# EAGLE design KitchenTimer_v2 (EAGLE 9.3.0)
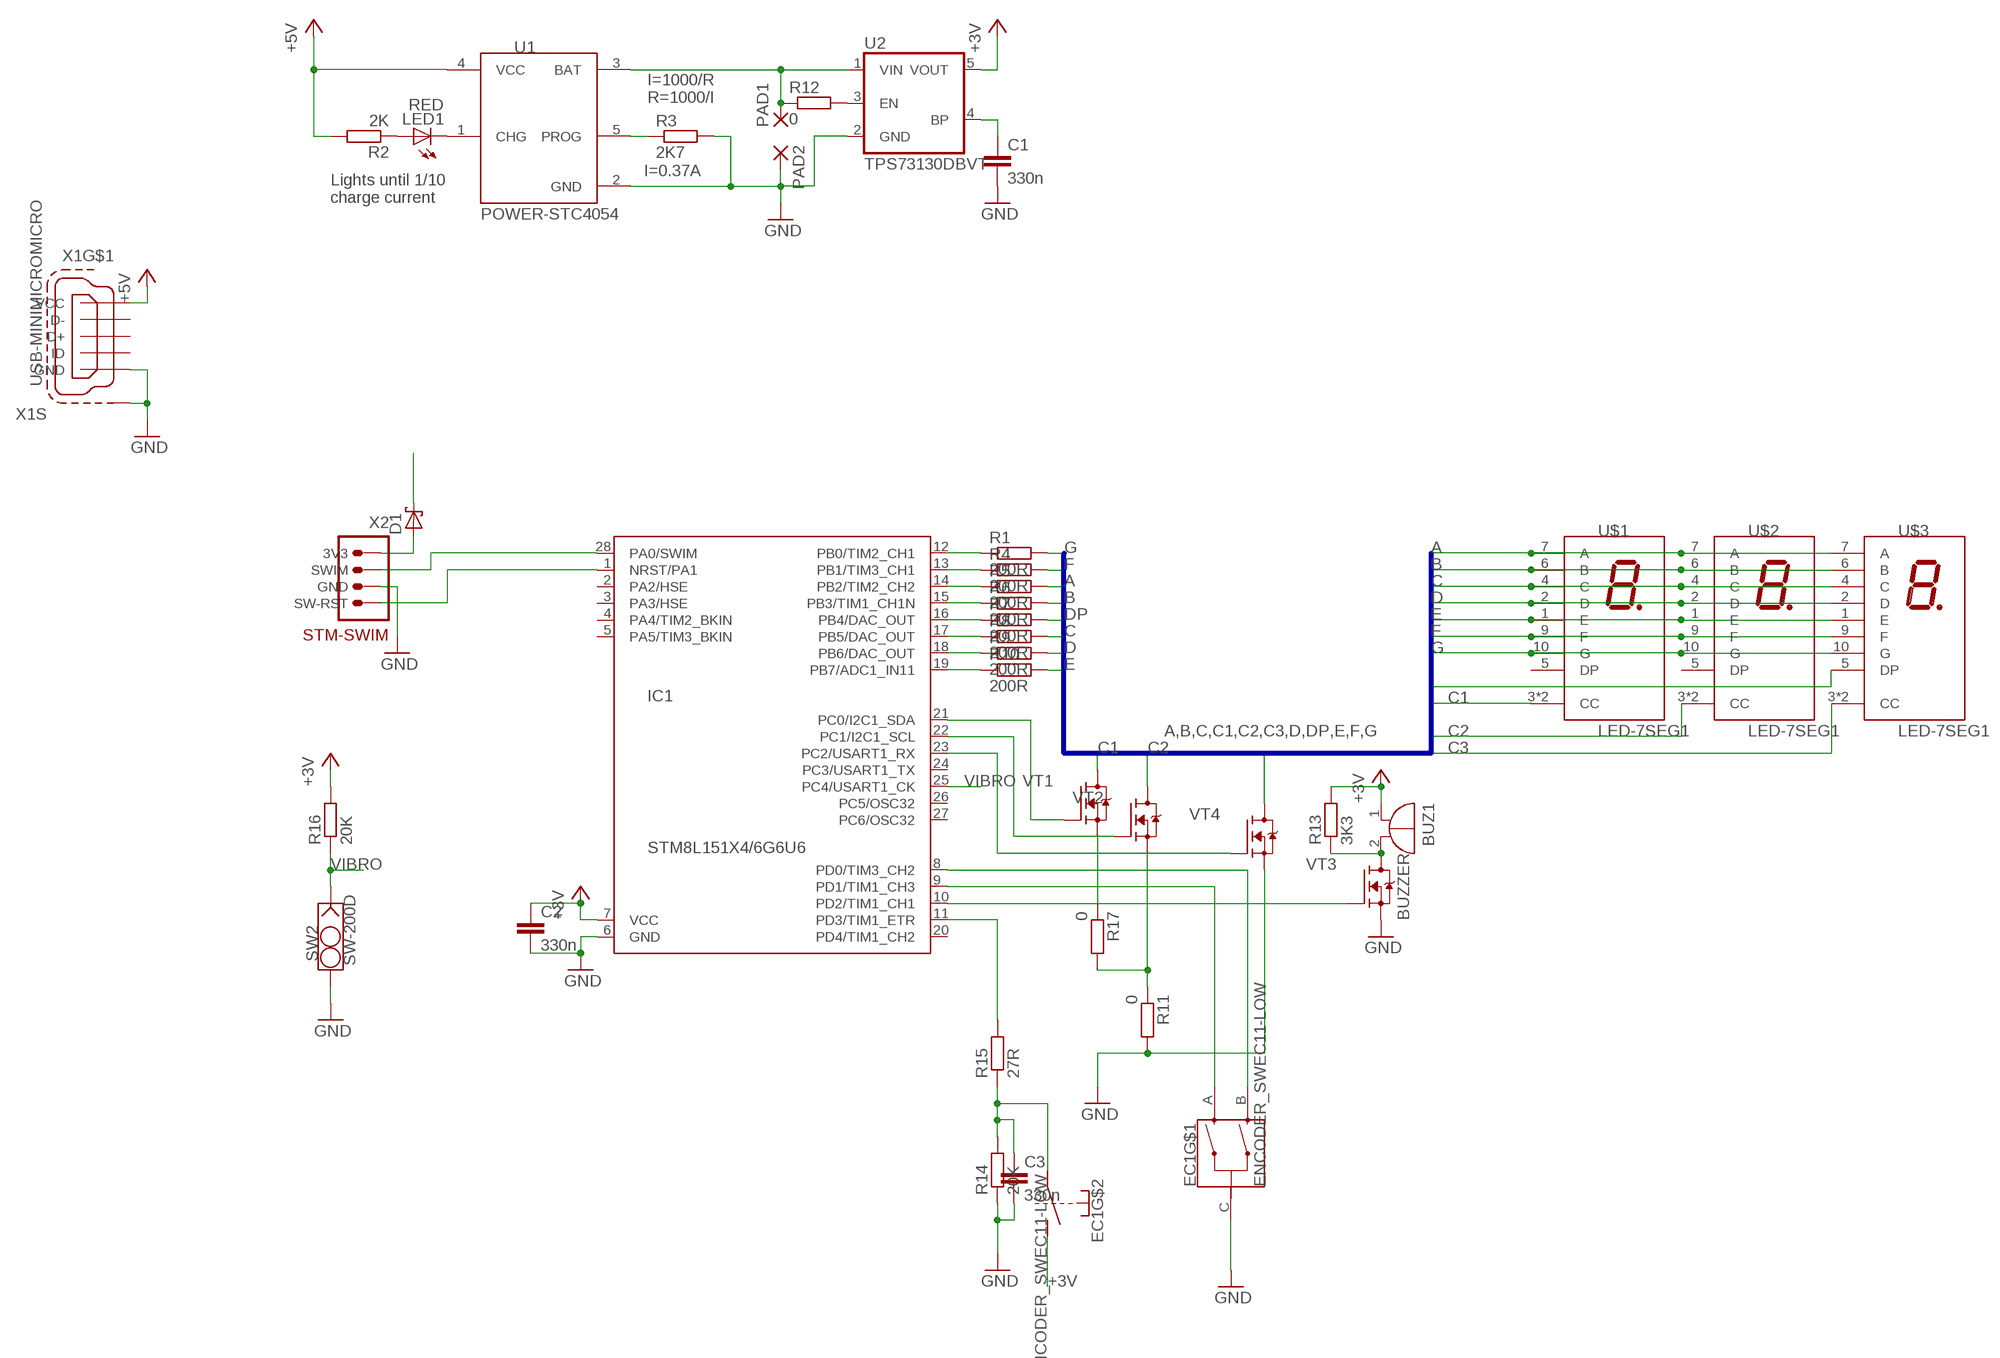
[diagram p0: schematic, sheet 1]

## Parts
BUZ1  BUZZER  [PIEZO-D12_H9]
C1  330n  CAP_1206  [CAP1206]
C2  330n  CAP_1206  [CAP1206]
C3  330n  CAP_1206  [CAP1206]
D1  DIODE-SH_SOD523  [SODFL1608X65]
EC1  ENCODER_SWEC11-LOW  [EC11E1544505]
IC1  STM8L151X4/6G6U6  [QFN28]
LED1  RED  LED_1206  [LED1206]
PAD1  1,6/0,9  [1,6/0,9]
PAD2  1,6/0,9  [1,6/0,9]
R1  200R  R_R0805  [RESC2012X50]
R2  2K  R_R0805  [RESC2012X50]
R3  2K7  R_R0805  [RESC2012X50]
R4  200R  R_R0805  [RESC2012X50]
R5  200R  R_R0805  [RESC2012X50]
R6  200R  R_R0805  [RESC2012X50]
R7  200R  R_R0805  [RESC2012X50]
R8  200R  R_R0805  [RESC2012X50]
R9  200R  R_R0805  [RESC2012X50]
R10  200R  R_R0805  [RESC2012X50]
R11  0  R_R0805  [RESC2012X50]
R12  0  R_R0805  [RESC2012X50]
R13  3K3  R_R1206  [RESC3216X60]
R14  20K  R_R1206  [RESC3216X60]
R15  27R  R_R1206  [RESC3216X60]
R16  20K  R_R1206  [RESC3216X60]
R17  0  R_R0805  [RESC2012X50]
SW2  SW-200D  [SW-200D]
U1  POWER-STC4054  [SOT95P280X145-5]
U2  TPS73130DBVT  VREG-LD2985  [SOT95P280X145-5]
U$1  LED-7SEG1  [LED-7SEG1]
U$2  LED-7SEG1  [LED-7SEG1]
U$3  LED-7SEG1  [LED-7SEG1]
VT1  FET-NSOT-23  [SOT95P240X115-3]
VT2  FET-NSOT-23  [SOT95P240X115-3]
VT3  FET-NSOT-23  [SOT95P240X115-3]
VT4  FET-NSOT-23  [SOT95P240X115-3]
X1  USB-MINIMICROMICRO  [USB-B-MICRO-SMD]
X2  STM-SWIMPOGOPADS  [SWIM-PADS-1.27]

## Nets
+3V: BUZ1.1(+) C2.1 D1.1(C) EC1.E IC1.7(VCC) R13.2 R16.2 U2.5(VOUT)
+5V: R2.2 U1.4(VCC) X1.VBUS(VCC)
A: R5.2 U$1.7(A) U$2.7(A) U$3.7(A)
B: R6.2 U$1.6(B) U$2.6(B) U$3.6(B)
C: R8.2 U$1.4(C) U$2.4(C) U$3.4(C)
C1: U$1.3(CC) U$1.8(CC) VT1.3(D)
C2: U$2.3(CC) U$2.8(CC) VT2.3(D)
C3: U$3.3(CC) U$3.8(CC) VT4.3(D)
D: R9.2 U$1.2(D) U$2.2(D) U$3.2(D)
DP: R7.2 U$3.5(DP)
E: R10.2 U$1.1(E) U$2.1(E) U$3.1(E)
F: R4.2 U$1.9(F) U$2.9(F) U$3.9(F)
G: R1.2 U$1.10(G) U$2.10(G) U$3.10(G)
GND: C1.2 C2.2 C3.2 EC1.C IC1.6(GND) PAD2.1(P) R3.2 R11.2 R14.1 SW2.S U1.2(GND) U2.2(GND) VT3.2(S) VT4.2(S) X1.GND X1.SHIELD1(S:S1) X1.SHIELD2(S:S1) X1.SHIELD3(S:S1) X2.P$3(GND)
N$1: LED1.C U1.1(CHG)
N$2: LED1.A R2.1
N$3: IC1.12(PB0/TIM2_CH1) R1.1
N$4: IC1.13(PB1/TIM3_CH1) R4.1
N$5: R3.1 U1.5(PROG)
N$6: IC1.14(PB2/TIM2_CH2) R5.1
N$7: PAD1.1(P) R12.1 U1.3(BAT) U2.1(VIN)
N$8: IC1.15(PB3/TIM1_CH1N) R6.1
N$9: IC1.16(PB4/DAC_OUT) R7.1
N$10: IC1.17(PB5/DAC_OUT) R8.1
N$11: IC1.18(PB6/DAC_OUT) R9.1
N$12: IC1.19(PB7/ADC1_IN11) R10.1
N$13: IC1.21(PC0/I2C1_SDA) VT1.1(G)
N$14: IC1.22(PC1/I2C1_SCL) VT2.1(G)
N$15: R11.1 R17.2 VT2.2(S)
N$16: R12.2 U2.3(EN)
N$17: C1.1 U2.4(BP)
N$18: BUZ1.2(-) R13.1 VT3.3(D)
N$19: IC1.10(PD2/TIM1_CH1) VT3.1(G)
N$20: C3.1 EC1.D R14.2 R15.1
N$21: IC1.11(PD3/TIM1_ETR) R15.2
N$22: IC1.28(PA0/SWIM) X2.P$2(SWIM)
N$23: IC1.1(NRST/PA1) X2.P$4(SW-RST)
N$24: D1.2(A) X2.P$1(3V3)
N$25: EC1.A IC1.9(PD1/TIM1_CH3)
N$26: EC1.B IC1.8(PD0/TIM3_CH2)
N$27: IC1.23(PC2/USART1_RX) VT4.1(G)
N$28: R17.1 VT1.2(S)
VIBRO: IC1.25(PC4/USART1_CK) R16.1 SW2.G
Unconnected: IC1.2(PA2/HSE) IC1.3(PA3/HSE) IC1.4(PA4/TIM2_BKIN) IC1.5(PA5/TIM3_BKIN) IC1.20(PD4/TIM1_CH2) IC1.24(PC3/USART1_TX) IC1.26(PC5/OSC32) IC1.27(PC6/OSC32) U$1.5(DP) U$2.5(DP) X1.D+ X1.D- X1.ID

## Buses
A,B,C,C1,C2,C3,D,DP,E,F,G

## Notes on the sheet
- I=1000/R
  R=1000/I
- I=0.37A
- Lights until 1/10
  charge current

## Library data of the parts
BUZ1 = Flamberm:BUZZER
C1-C3 = Flamberm:CAP_
D1 = Flamberm:DIODE-SH_
EC1 = Flamberm:ENCODER_SW
IC1 = Flamberm:STM8L151X4/6
LED1 = Flamberm:LED_
PAD1 PAD2 = wirepad:1,6/0,9: THROUGH-HOLE PAD
R1-R17 = Flamberm:R_
SW2 = Flamberm:SW-200D
U1 = Flamberm:POWER-STC4054
U2 = Flamberm:VREG-LD2985
U$1-U$3 = Flamberm:LED-7SEG1
VT1-VT4 = Flamberm:FET-N
X1 = Flamberm:USB-MINIMICRO: MINI USB-B Conector Source: www.cypressindustries.com
X2 = Flamberm:STM-SWIM

## Board
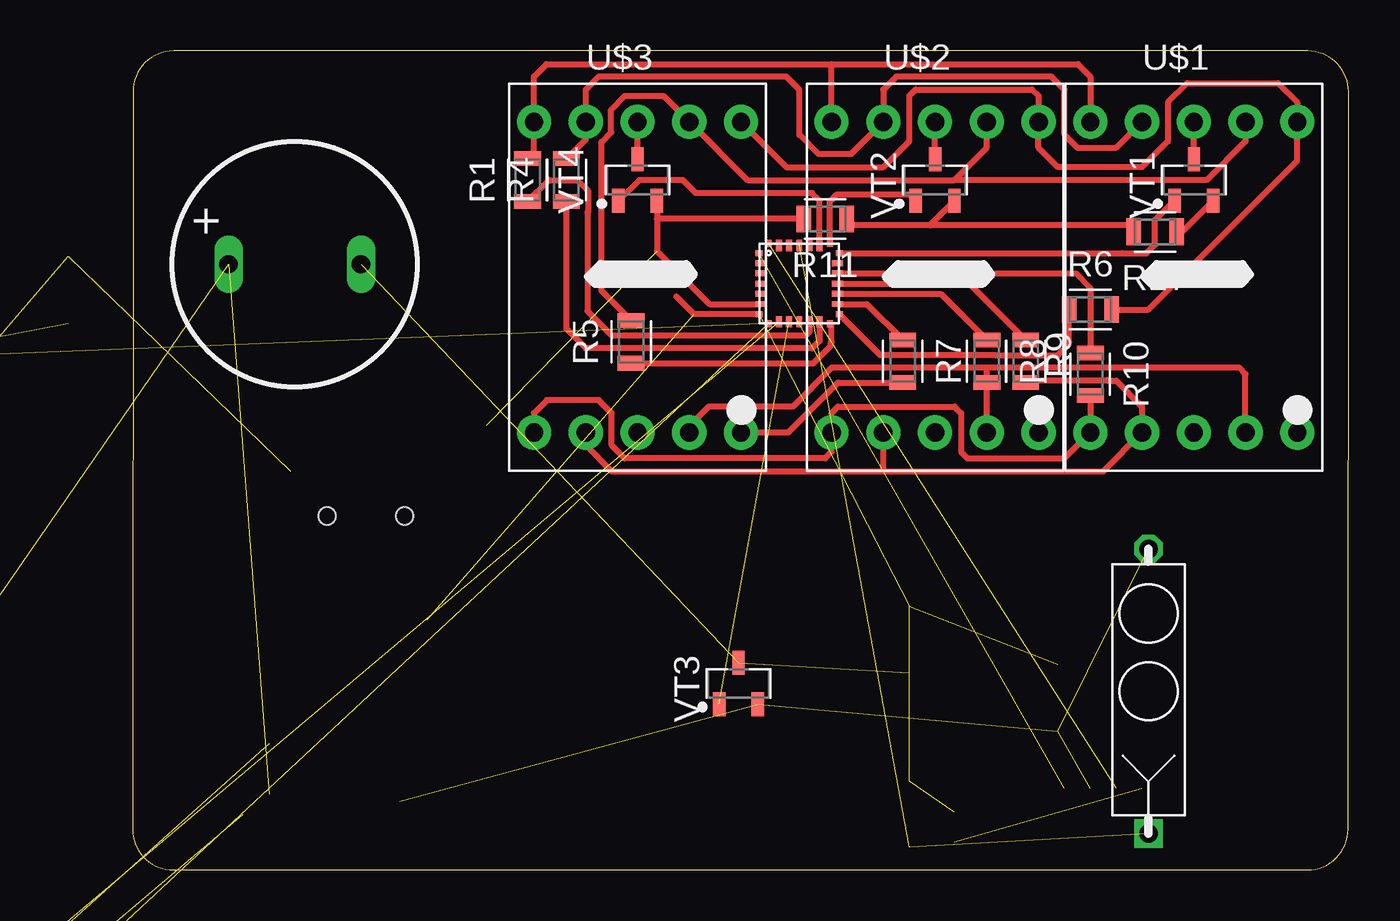
[diagram p1: board, top side]
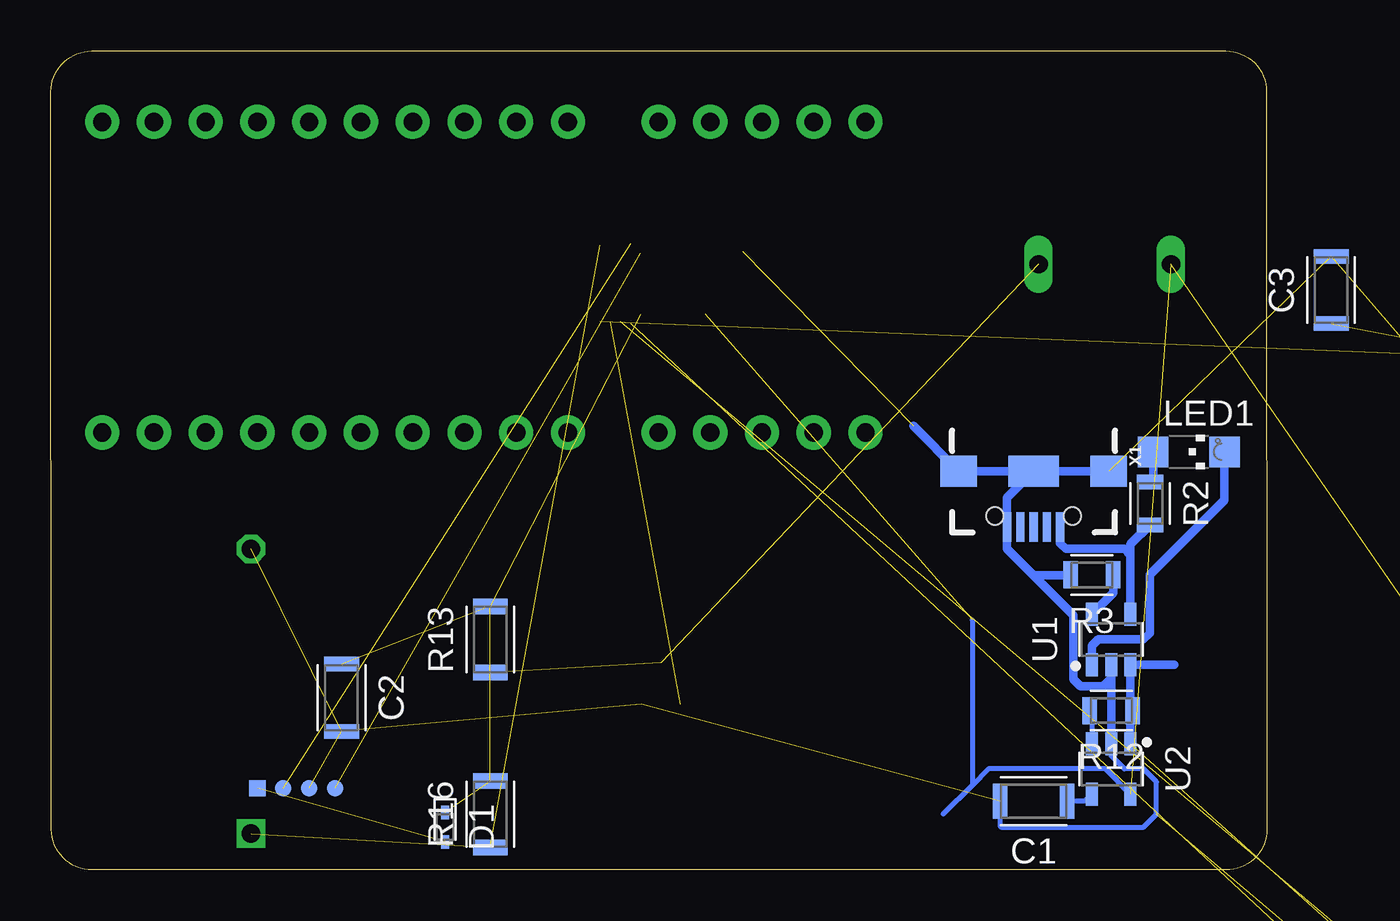
[diagram p2: board, bottom side, seen from below]

Size 59.69 x 40.18 mm. Coordinates in mm from the lower left corner, seen from the top.
Outline: 2,0 57.67,0 arc90 59.67,2 59.69,38.18 arc90 57.69,40.18 2.02,40.18 arc90 0.02,38.18 0,2 arc90 2,0
Copper layers (1*16): Top 0.035mm / dielectric 1.5mm / Bottom 0.035mm
Design rules "EagleDesignRules": minimum track width 0.25mm, minimum drill 0.3mm, track to track 0.25mm, track to pad 0.25mm, pad to pad 0.25mm, via to via 0.25mm, smd to smd 0.25mm, copper to edge 0.5mm, drill to drill 0.5mm, minimum pad ring 10mil, minimum via ring 8mil, stop-mask expansion 4mil, vias tented up to drill 0mil, thermal gap 0.25mm

### Footprints (pad centres in the part's own frame; a part is rotated, then mirrored left to right if it is on the bottom)
PIEZO-D12_H9 = drill 0.9 long: 1 -3.25,0; 2 3.25,0
CAP1206 = smd 0.712 x 1.712: 1 -1.65,0; 2 1.65,0
SODFL1608X65 = smd 0.66 x 0.398: 1 -0.72,0; 2 0.72,0
EC11E1544505 = smd 1.3 x 2.4: A -2.5,-7.3; B 2.5,-7.3; C 0,-7.3; D -2.5,7; E 2.5,7 | smd 3.75 x 4: P$1 -6.375,0; P$2 6.375,0 | smd 2.5 x 3.2: P$3 -5,7.9; P$4 5,7.9; P$5 5,-7.9; P$6 -5,-7.9 | hole 2: 0,0 | hole 1.5: 0,-4.5
QFN28 = smd 0.35 x 0.29: 1 -1.975,1.5; 7 -1.975,-1.5; 15 1.975,-1.5; 21 1.975,1.5 | smd 0.55 x 0.29: 2 -1.875,1; 3 -1.875,0.5; 4 -1.875,0; 5 -1.875,-0.5; 6 -1.875,-1; 16 1.875,-1; 17 1.875,-0.5; 18 1.875,0; 19 1.875,0.5; 20 1.875,1 | smd 0.29 x 0.35: 8 -1.5,-1.975; 14 1.5,-1.975; 22 1.5,1.975; 28 -1.5,1.975 | smd 0.29 x 0.55: 9 -1,-1.875; 10 -0.5,-1.875; 11 0,-1.875; 12 0.5,-1.875; 13 1,-1.875; 23 1,1.875; 24 0.5,1.875; 25 0,1.875; 26 -0.5,1.875; 27 -1,1.875
LED1206 = smd 1.5 x 1.5: A 0,-1.75; C 0,1.75
1,6/0,9 = drill 0.914 pad 1.6 octagon: 1 0,0
RESC2012X50 = smd 0.712 x 1.312: 1 -1.05,0; 2 1.05,0
RESC3216X60 = smd 0.762 x 1.712: 1 -1.625,0; 2 1.625,0
SW-200D = drill 0.9 square: G 6.985,0 | drill 0.9 octagon: S -6.985,0
SOT95P280X145-5 = smd 1.127 x 0.589: 1 -1.242,0.95; 2 -1.242,0; 3 -1.242,-0.95; 4 1.242,-0.95; 5 1.242,0.95
LED-7SEG1 = drill 0.9 pad 1.676: 1 -5.08,-7.62; 2 -2.54,-7.62; 3 0,-7.62; 4 2.54,-7.62; 5 5.08,-7.62; 6 5.08,7.62; 7 2.54,7.62; 8 0,7.62; 9 -2.54,7.62; 10 -5.08,7.62
SOT95P240X115-3 = smd 1.18 x 0.609: 1 -1.024,0.95; 2 -1.024,-0.95; 3 1.024,0
USB-B-MICRO-SMD = smd 1.45 x 0.4: D+ 2.725,0; D- 2.725,0.65; GND 2.725,-1.3; ID 2.725,-0.65; VBUS 2.725,1.3 | smd 1.5 x 1.8: SHIELD1 0,3.685; SHIELD2 0,-3.685 | smd 1.5 x 2.5: SHIELD3 0,0 | hole 0.85: 2.2,1.9; 2.2,-1.9
SWIM-PADS-1.27 = smd 0.8 x 0.8: P$1 -1.27,0; P$2 0,0; P$3 1.27,0; P$4 2.54,0

### Placement (x,y rotation side)
BUZ1  7.96,29.72 0 top
C1  11.45,3.37 180 bottom
C2  45.42,8.45 270 bottom
C3  -3.16,28.45 90 bottom  (outside the outline)
D1  40.34,2.1 270 bottom
EC1  -23.48,-14.41 0 top  (outside the outline)
IC1  32.72,28.77 0 top
LED1  3.83,20.51 270 bottom
PAD1  -30.46,-27.11 0 top  (outside the outline)
PAD2  -30.46,-31.24 0 top  (outside the outline)
R1  19.39,33.85 90 top
R2  5.73,17.97 270 bottom
R3  8.59,14.48 180 bottom
R4  21.29,33.85 90 top
R5  24.47,25.91 90 top
R6  47.01,27.5 0 top
R7  37.8,24.96 270 top
R8  41.93,24.96 270 top
R9  43.83,24.96 270 top
R10  47.01,24.32 270 top
R11  33.99,31.94 180 top
R12  7.64,7.81 180 bottom
R13  38.12,11.3 90 bottom
R14  -9.19,21.46 270 bottom  (outside the outline)
R15  -9.51,25.27 180 bottom  (outside the outline)
R16  38.12,2.73 90 bottom
R17  50.18,31.31 180 top
SW2  49.87,8.76 270 top
U1  7.64,11.3 90 bottom
U2  7.64,4.95 270 bottom
U$1  52.09,29.08 0 top
U$2  39.39,29.08 0 top
U$3  24.78,29.08 0 top
VT1  52.09,33.85 90 top
VT2  39.39,33.85 90 top
VT3  29.74,9.14 90 top
VT4  24.78,33.85 90 top
X1  11.45,19.56 270 bottom
X2  48.28,4 0 bottom

### Tracks (layer width: path | path; a pad name or v marks a point on that pad's centre or on a via)
+3V  (7 unrouted)
  Top 0.305: IC1.7 27.55,27.27 26.69,28.13
  Bottom 0.25: U2.5 7.93,4.95 13.67,4.95 14.47,4.16 | 14.47,4.16 15.89,2.73 | 14.47,12.26 14.47,4.16
+5V
  Bottom 0.406: U1.4 6.69,15.43 | 6.69,15.43 6.69,15.97 R2.2 | X1.VBUS 10.15,16.04 9.86,15.75 7.01,15.75 6.69,15.43
A
  Top 0.305: 40.34,33.84 41.93,35.43 U$2.7 | U$1.7 54.63,35.75 52.72,33.84 40.34,33.84 | 40.34,33.84 30.18,33.84 U$3.7 26.05,37.97 24.15,37.97 23.49,37.31 23.49,36.19 23.01,35.71 23.01,28.42 R5.2 24.47,26.86
B
  Top 0.305: U$3.6 32.09,34.48 36.85,34.48 38.12,35.75 38.12,37.97 38.44,38.29 44.15,38.29 44.47,37.97 U$2.6 | U$2.6 44.47,36.07 | U$2.6 44.47,35.43 45.42,34.48 49.55,34.48 50.82,35.75 50.82,37.65 51.77,38.61 56.22,38.61 57.17,37.65 U$1.6 57.17,34.8 51.77,29.4 51.61,29.24 49.87,27.5 R6.2
C
  Top 0.305: U$1.4 54.63,24.32 54.31,24.64 41.93,24.64 | 41.93,24.64 34.31,24.64 32.4,22.73 28.28,22.73 27.32,21.78 U$3.4 | U$2.4 R8.2 41.93,24.64
C1
  Top 0.305: VT1.3 U$1.8
C2
  Top 0.305: VT2.3 U$2.8
C3
  Top 0.305: VT4.3 U$3.8
D
  Top 0.305: U$3.2 22.24,20.83 23.51,19.56 36.85,19.56 | 36.85,19.56 U$2.2 | 36.85,19.56 47.64,19.56 U$1.2 49.55,22.73 48.28,24 47.86,24 47.83,24.03 43.96,24.03 R9.2
DP
  Top 0.305: R7.2 34.63,23.91 32.18,21.46 U$3.5
E
  Top 0.305: U$3.1 19.7,22.42 20.34,23.05 22.88,23.05 23.51,22.42 23.51,20.83 24.15,20.19 33.99,20.19 34.31,20.51 U$2.1 34.31,22.42 34.63,22.73 40.34,22.73 40.66,22.42 40.66,20.51 40.98,20.19 45.74,20.19 U$1.1 R10.2
F
  Top 0.305: U$1.9 48.28,35.43 46.37,35.43 45.74,36.07 45.74,38.29 45.1,38.93 37.48,38.93 36.85,38.29 U$2.9 35.26,35.11 33.67,35.11 32.72,36.07 32.72,38.29 32.09,38.93 22.88,38.93 22.24,38.29 U$3.9 22.24,35.85 R4.2
G
  Top 0.305: U$1.10 47.01,38.93 46.4,39.53 34.31,39.53 | 34.31,39.53 20.31,39.53 19.7,38.93 U$3.10 19.7,35.21 R1.2 | U$2.10 34.31,39.53
GND  (9 unrouted)
  Top 0.305: IC1.6 28.32,27.77 25.73,30.36 25.73,31.94 | VT4.2 25.73,31.94 | R11.2 25.73,31.94
  Bottom 0.25: U2.2 7.64,5.59 7,4.95 6.05,4.95 5.42,4.32 5.42,2.73 6.05,2.1 13.04,2.1 13.1,2.16 C1.2
  Bottom 0.406: X1.SHIELD3 12.75,18.26 X1.GND 12.75,15.75 11.46,14.46 | X1.SHIELD3 X1.SHIELD2 17.36,21.78 | X1.SHIELD3 X1.SHIELD1 | U1.2 7.64,9.4 | 7.64,9.4 8.02,9.02 9.16,9.02 9.49,9.34 9.49,12.48 11.46,14.46 | R3.2 9.66,14.46 11.46,14.46 | U2.2 7.64,9.4
N$1
  Bottom 0.406: LED1.C 2.08,18.13 5.73,14.48 5.73,11.62 6.05,11.3 8.27,11.3 8.59,10.99 U1.1
N$2
  Bottom 0.406: R2.1 5.58,19.18 LED1.A
N$3
  Top 0.305: R1.1 20.44,33.84 21.82,33.84 22.32,33.34 22.35,33.32 22.35,32.27 22.32,32.25 22.32,27.42 23.54,26.2 33.02,26.2 33.22,26.4 IC1.12
N$4
  Top 0.305: R4.1 21.29,26.54 22.24,25.59 33.36,25.59 33.72,25.96 IC1.13
N$5
  Bottom 0.406: R3.1 7.54,13.59 U1.5
N$6
  Top 0.305: 34.28,25.88 34.28,25.73 33.41,24.86 R5.1 | 34.28,25.88 34.31,25.91 | IC1.14 34.28,26.74 34.28,25.88
N$7  (1 unrouted)
  Bottom 0.25: R12.1 6.69,7.81
  Bottom 0.406: 4.53,10.06 U1.3 6.69,7.81 U2.1
N$8
  Top 0.305: IC1.15 36.69,25.27 42.35,25.27 42.38,25.25 45.42,25.25 45.95,25.78 45.95,25.89 45.96,25.9 R6.1
N$9
  Top 0.305: IC1.16 36.04,27.77 R7.1
N$10
  Top 0.305: IC1.17 39.67,28.27 R8.1
N$11
  Top 0.305: IC1.18 41.07,28.77 R9.1
N$12
  Top 0.305: IC1.19 46.29,29.27 47.01,28.55 R10.1
N$13
  Top 0.305: IC1.21 48.59,30.27 48.61,30.25 49.76,30.25 50.18,30.67 50.18,31.87 VT1.1
N$14
  Top 0.305: IC1.22 34.22,32.8 34.55,33.14 38.12,33.14 VT2.1
N$15
  Top 0.305: VT2.2 39.14,31.62 | R11.1 35.36,31.62 39.14,31.62 | R17.2 48.82,31.62 39.14,31.62
N$16
  Bottom 0.25: R12.2 8.59,7.71 U2.3
N$17
  Bottom 0.25: U2.4 8.93,3.37 C1.1
N$18  (2 unrouted)
N$19  (1 unrouted)
N$20  (3 unrouted)
N$21  (1 unrouted)
N$22  (1 unrouted)
N$23  (1 unrouted)
N$24  (1 unrouted)
N$25  (1 unrouted)
N$26  (1 unrouted)
N$27
  Top 0.305: IC1.23 33.72,32.84 33.36,33.21 27.64,33.21 27.01,33.84 24.86,33.84 VT4.1
N$28
  Top 0.305: R17.1 51.52,31.31 VT1.2
VIBRO  (2 unrouted)